# EAGLE schematic Laser_Array (EAGLE 7.7.0)
Laser Array
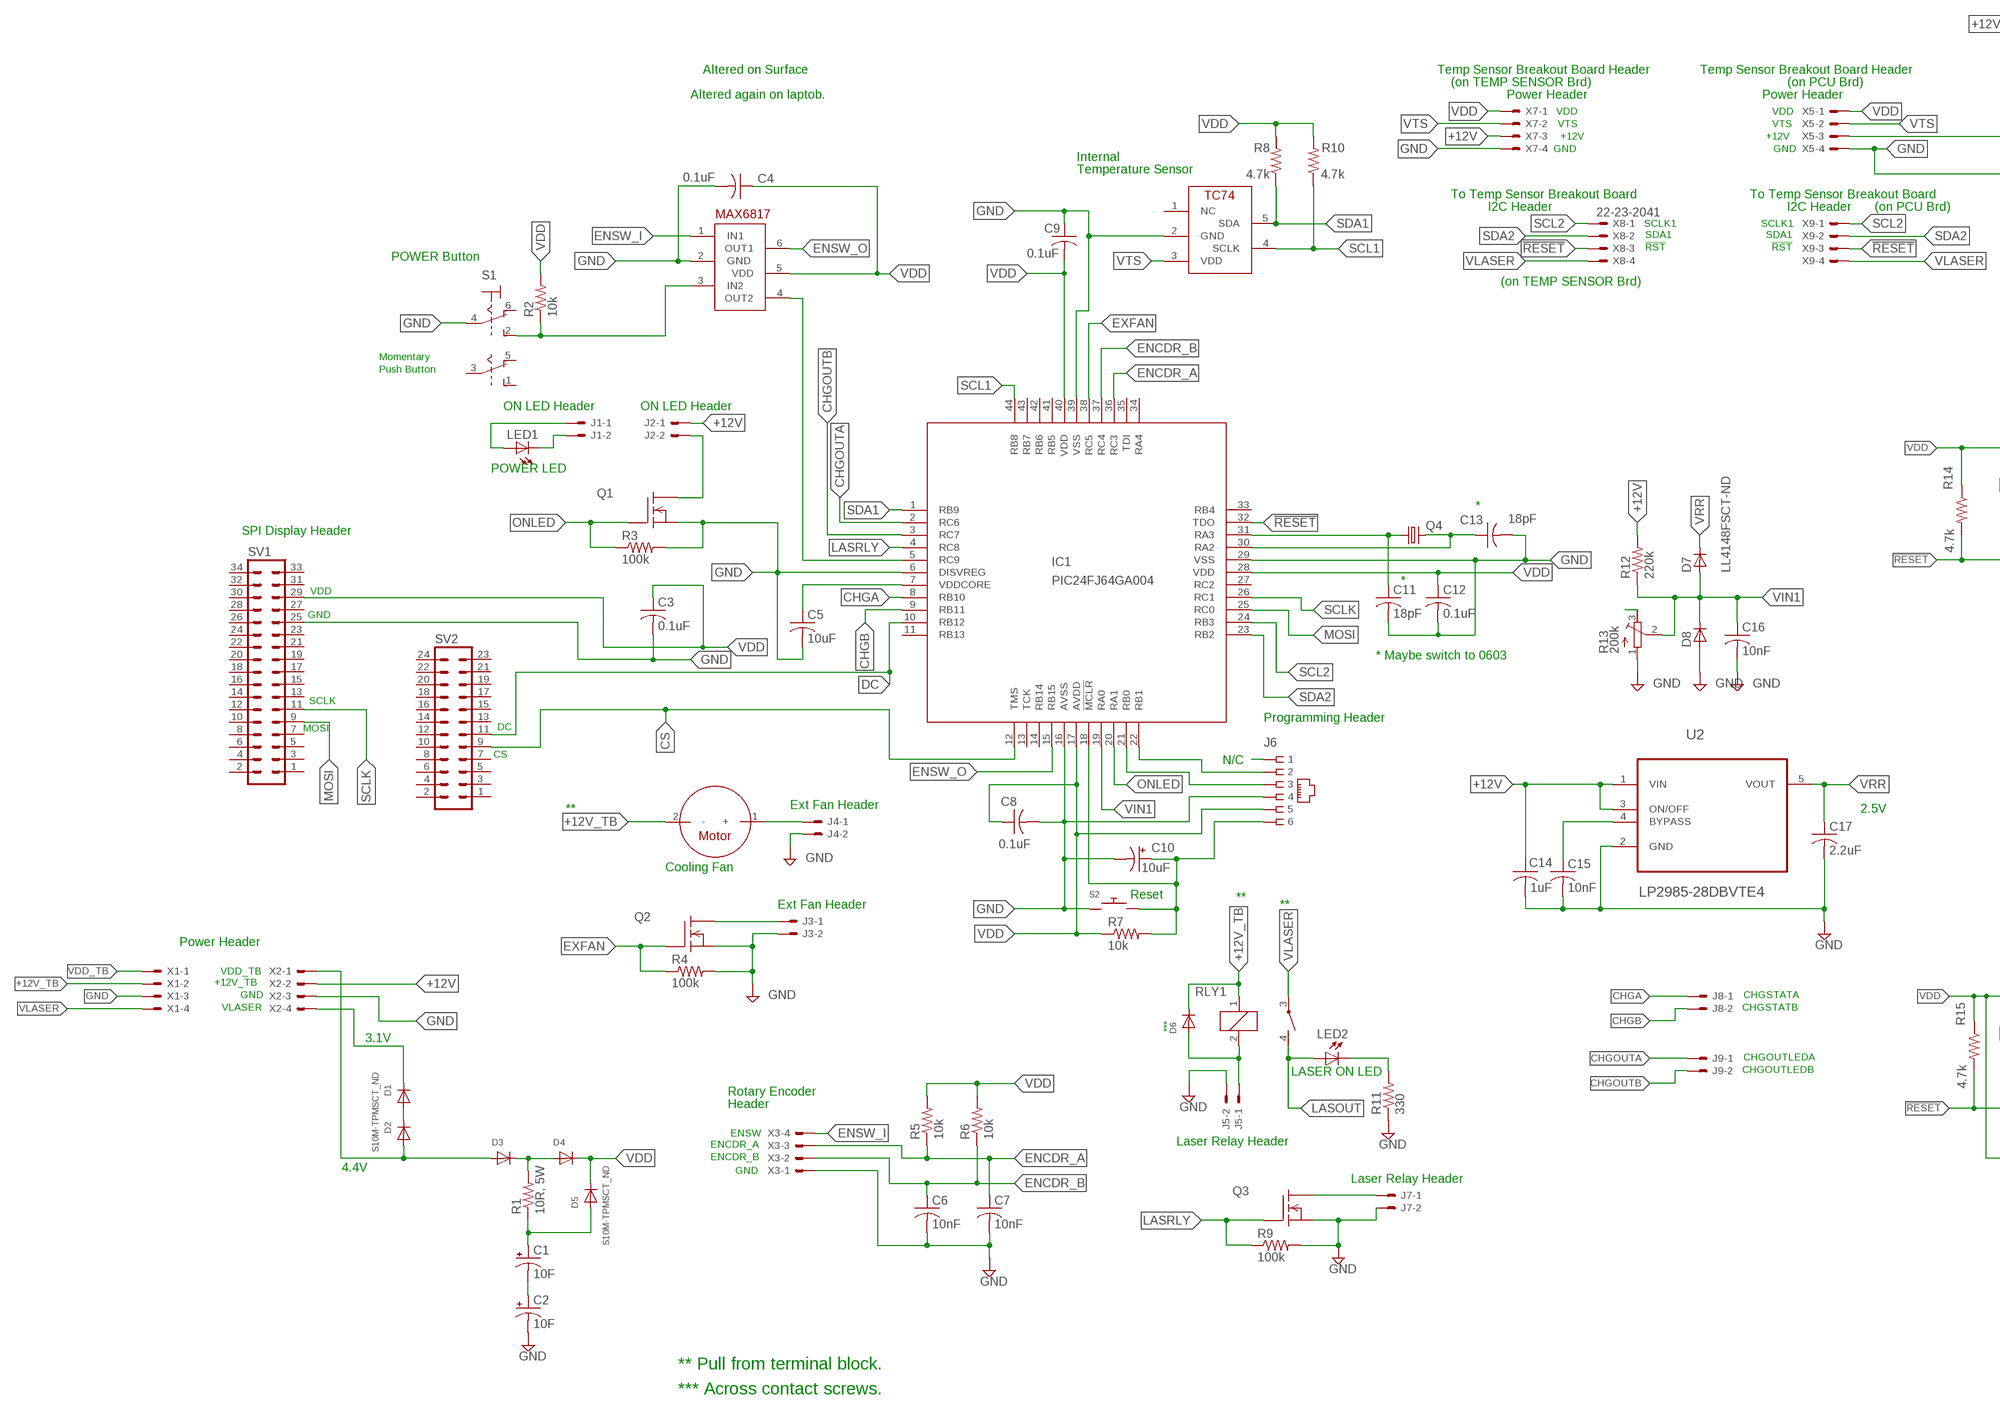
[diagram p0: schematic, sheet 1, part 1 of 2]
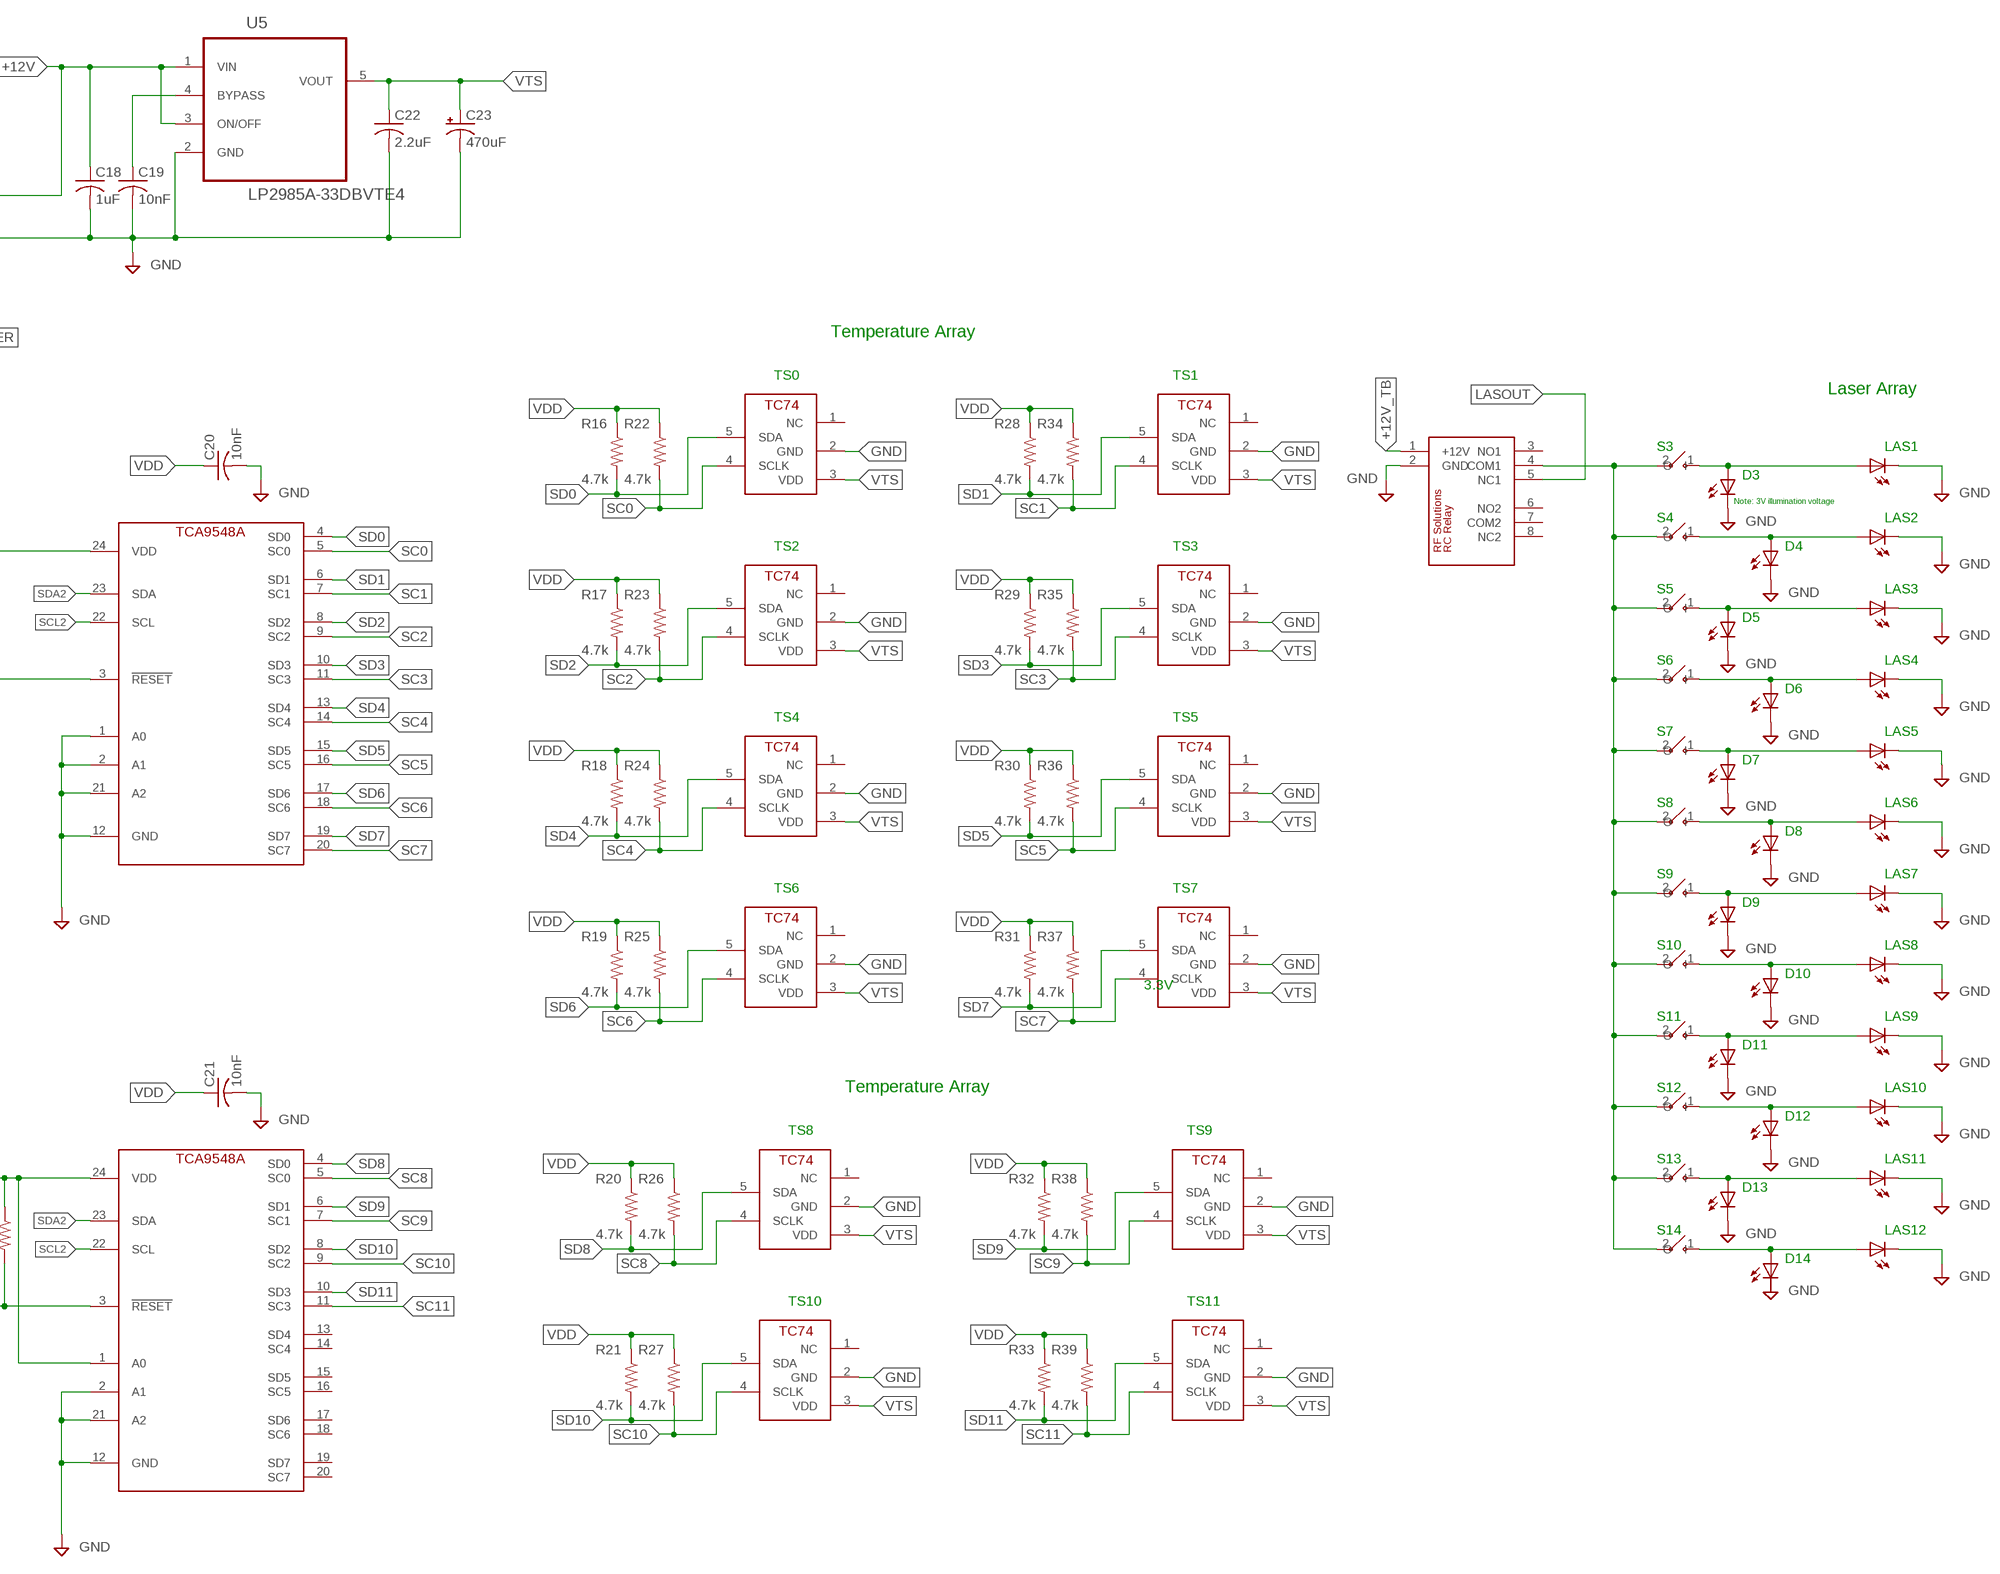
[diagram p1: schematic, sheet 1, part 2 of 2]

## Parts
C1  10F  CPOL-USE5-10.5  [E5-10,5]
C2  10F  CPOL-USE5-10.5  [E5-10,5]
C3  0.1uF  C-USC0805  [C0805]
C4  0.1uF  C-USC0805  [C0805]
C5  10uF  C-USC0805  [C0805]
C6  10nF  C-USC0805  [C0805]
C7  10nF  C-USC0805  [C0805]
C8  0.1uF  C-USC0805  [C0805]
C9  0.1uF  C-USC0805  [C0805]
C10  10uF  CAP3X3  [CAP3X3]
C11  18pF  C-USC0805  [C0805]
C12  0.1uF  C-USC0805  [C0805]
C13  18pF  C-USC0805  [C0805]
C14  1uF  C-USC0805  [C0805]
C15  10nF  C-USC0805  [C0805]
C16  10nF  C-USC0805  [C0805]
C17  2.2uF  C-USC0805  [C0805]
C18  1uF  C-USC0805  [C0805]
C19  10nF  C-USC0805  [C0805]
C20  10nF  C-USC0805  [C0805]
C21  10nF  C-USC0805  [C0805]
C22  2.2uF  C-USC0805  [C0805]
C23  470uF  CPOL-USF  [PANASONIC_F]
D1  S10M-TPMSCT_ND  [S10M-TPMSCT-ND]
D2  641-1014-6-ND  DIODESOD-123  [SOD-123]
D3  641-1014-6-ND  DIODESOD-123  [SOD-123]
D4  641-1014-6-ND  DIODESOD-123  [SOD-123]
D5  S10M-TPMSCT_ND  [S10M-TPMSCT-ND]
D6  641-1014-6-ND  DIODESOD-123  [SOD-123]
D7  LL4148FSCT-ND  D-SOD-80  [SOD80]
D8  LL4148FSCT-ND  D-SOD-80  [SOD80]
IC1  PIC24FJ64GA004  [TQFP44]
J1  22-23-2021  [22-23-2021]
J2  22-23-2021  [22-23-2021]
J3  22-23-2021  [22-23-2021]
J4  22-23-2021  [22-23-2021]
J5  22-23-2021  [22-23-2021]
J6  RJ_25  [RJ11-NO_SHIELD]
J7  22-23-2021  [22-23-2021]
J8  22-23-2021  [22-23-2021]
J9  22-23-2021  [22-23-2021]
LED1  LEDA5MM  [LED5MM]
LED2  LEDA5MM  [LED5MM]
LED3  LED3MM  [LED3MM]
LED4  LED3MM  [LED3MM]
LED5  LED3MM  [LED3MM]
LED6  LED3MM  [LED3MM]
LED7  LED3MM  [LED3MM]
LED8  LED3MM  [LED3MM]
LED9  LED3MM  [LED3MM]
LED10  LED3MM  [LED3MM]
LED11  LED3MM  [LED3MM]
LED12  LED3MM  [LED3MM]
LED13  LED3MM  [LED3MM]
LED14  LED3MM  [LED3MM]
LED15  LED3MM  [LED3MM]
LED16  LED3MM  [LED3MM]
LED17  LED3MM  [LED3MM]
LED18  LED3MM  [LED3MM]
LED19  LED3MM  [LED3MM]
LED20  LED3MM  [LED3MM]
LED21  LED3MM  [LED3MM]
LED22  LED3MM  [LED3MM]
LED23  LED3MM  [LED3MM]
LED24  LED3MM  [LED3MM]
LED25  LED3MM  [LED3MM]
LED26  LED3MM  [LED3MM]
M1  MOTOR  [22-23-2021]
Q1  QS5U34CT-ND_MOSFET_N_CHANNEL  [SOT23-5L]
Q2  QS5U34CT-ND_MOSFET_N_CHANNEL  [SOT23-5L]
Q3  QS5U34CT-ND_MOSFET_N_CHANNEL  [SOT23-5L]
Q4  CRYSTALSM49  [SM49]
R1  10R, 5W  RESISTOR5W  [RESISTOR5W]
R2  10k  R-US_R0805  [R0805]
R3  100k  R-US_R0805  [R0805]
R4  100k  R-US_R0805  [R0805]
R5  10k  R-US_M0805  [M0805]
R6  10k  R-US_M0805  [M0805]
R7  10k  R-US_R0805  [R0805]
R8  4.7k  R-US_M0805  [M0805]
R9  100k  R-US_R0805  [R0805]
R10  4.7k  R-US_M0805  [M0805]
R11  330  R-US_R0805  [R0805]
R12  220k  R-US_M0805  [M0805]
R13  200k  R-TRIMM3224X  [RTRIM3224X]
R14  4.7k  R-US_M0805  [M0805]
R15  4.7k  R-US_M0805  [M0805]
R16  4.7k  R-US_M0805  [M0805]
R17  4.7k  R-US_M0805  [M0805]
R18  4.7k  R-US_M0805  [M0805]
R19  4.7k  R-US_M0805  [M0805]
R20  4.7k  R-US_M0805  [M0805]
R21  4.7k  R-US_M0805  [M0805]
R22  4.7k  R-US_M0805  [M0805]
R23  4.7k  R-US_M0805  [M0805]
R24  4.7k  R-US_M0805  [M0805]
R25  4.7k  R-US_M0805  [M0805]
R26  4.7k  R-US_M0805  [M0805]
R27  4.7k  R-US_M0805  [M0805]
R28  4.7k  R-US_M0805  [M0805]
R29  4.7k  R-US_M0805  [M0805]
R30  4.7k  R-US_M0805  [M0805]
R31  4.7k  R-US_M0805  [M0805]
R32  4.7k  R-US_M0805  [M0805]
R33  4.7k  R-US_M0805  [M0805]
R34  4.7k  R-US_M0805  [M0805]
R35  4.7k  R-US_M0805  [M0805]
R36  4.7k  R-US_M0805  [M0805]
R37  4.7k  R-US_M0805  [M0805]
R38  4.7k  R-US_M0805  [M0805]
R39  4.7k  R-US_M0805  [M0805]
RLY1  RELAY_SPST  [RELAY_SPST]
RLY2  RF_SOLUTIONS_RELAY  [RF_SOLUTIONS_RELAY]
S1  DPDT_TOGGLE  [22-23-2061]
S2  TACT_PB  [PUSHBUTTON_SMD_SJ]
S3  TC74  [SOT23-5L]
S4  TC74  [SOT23-5L]
S5  TC74  [SOT23-5L]
S6  TC74  [SOT23-5L]
S7  TC74  [SOT23-5L]
S8  TC74  [SOT23-5L]
S9  TC74  [SOT23-5L]
S10  TC74  [SOT23-5L]
S11  TC74  [SOT23-5L]
S12  TC74  [SOT23-5L]
S13  TC74  [SOT23-5L]
S14  TC74  [SOT23-5L]
S15  TC74  [SOT23-5L]
S16  TOGGLE_SPST  [22-23-2021]
S17  TOGGLE_SPST  [22-23-2021]
S18  TOGGLE_SPST  [22-23-2021]
S19  TOGGLE_SPST  [22-23-2021]
S20  TOGGLE_SPST  [22-23-2021]
S21  TOGGLE_SPST  [22-23-2021]
S22  TOGGLE_SPST  [22-23-2021]
S23  TOGGLE_SPST  [22-23-2021]
S24  TOGGLE_SPST  [22-23-2021]
S25  TOGGLE_SPST  [22-23-2021]
S26  TOGGLE_SPST  [22-23-2021]
S27  TOGGLE_SPST  [22-23-2021]
SV1  MA17-2W  [MA17-2W]
SV2  MA12-2  [MA12-2]
U1  MAX6817  [SOT23-6]
U2  LP2985-28DBVTE4  [SOT95P280X145-5N]
U3  TCA9548A  [TSSOP24]
U4  TCA9548A  [TSSOP24]
U5  LP2985A-33DBVTE4  [SOT95P280X145-5N]
X1  22-23-2041  [22-23-2041]
X2  22-23-2041  [22-23-2041]
X3  22-23-2041  [22-23-2041]
X5  22-23-2041  [22-23-2041]
X7  22-23-2041  [22-23-2041]
X8  22-23-2041  [22-23-2041]
X9  22-23-2041  [22-23-2041]

## Nets
!RESET: IC1.32(TDO) R14.2 R15.2 U3.3(!RESET) U4.3(!RESET) X8.3 X9.3
+12V: C14.1 C18.1 J2.1 R12.2 U2.1(VIN) U2.3(ON/OFF) U5.1(VIN) U5.3(ON/OFF) X2.2 X5.3 X7.3
+12V_TB: D6.C M1.2(-) RLY1.1 RLY2.1(+12V) X1.2
CHGA: IC1.8(RB10) J8.1
CHGB: IC1.9(RB11) J8.2
CHGOUTA: IC1.2(RC6) J9.1
CHGOUTB: IC1.3(RC7) J9.2
CS: IC1.12(TMS) SV2.9
DC: IC1.10(RB12) SV2.11
ENCDR_A: C7.1 IC1.36(RC3) R5.1 X3.3
ENCDR_B: C6.1 IC1.37(RC4) R6.1 X3.2
ENSW_I: U1.1(IN1) X3.4
ENSW_O: IC1.15(RB15) U1.6(OUT1)
EXFAN: IC1.38(RC5) Q2.1(G) R4.1
GND: C2.- C3.2 C4.2 C5.2 C6.2 C7.2 C8.2 C9.1 C10.- C11.2 C12.2 C13.2 C14.2 C15.2 C16.2 C17.2 C18.2 C19.2 C20.2 C21.2 C22.2 C23.- D8.2(A) IC1.6(DISVREG) IC1.16(AVSS) IC1.29(VSS) IC1.39(VSS) J3.2 J4.2 J5.2 J6.4 J7.2 LED3.K(C) LED4.K(C) LED5.K(C) LED6.K(C) LED7.K(C) LED8.K(C) LED9.K(C) LED10.K(C) LED11.K(C) LED12.K(C) LED13.K(C) LED15.K(C) LED16.K(C) LED17.K(C) LED18.K(C) LED19.K(C) LED20.K(C) LED21.K(C) LED22.K(C) LED23.K(C) LED24.K(C) LED25.K(C) LED26.K(C) Q1.2(S) Q2.2(S) Q3.2(S) R3.2 R4.2 R9.2 R11.1 R13.1(A) RLY2.2(GND) S1.4(P) S2.1 S2.2 S3.2(GND) S4.2(GND) S5.2(GND) S6.2(GND) S7.2(GND) S8.2(GND) S9.2(GND) S10.2(GND) S11.2(GND) S12.2(GND) S13.2(GND) S14.2(GND) S15.2(GND) SV1.25 U1.2(GND) U2.2(GND) U3.1(A0) U3.2(A1) U3.12(GND) U3.21(A2) U4.2(A1) U4.12(GND) U4.21(A2) U5.2(GND) X1.3 X2.3 X3.1 X5.4 X7.4
LASOUT: LED2.A RLY1.4(2:S) RLY2.5(NC1)
LASRLY: IC1.4(RC8) Q3.1(G) R9.1
MOSI: IC1.25(RC0) SV1.9
N$1: C10.+ IC1.18(!MCLR) J6.6 R7.2 S2.3 S2.4
N$2: C5.1 IC1.7(VDDCORE)
N$3: J6.1
N$4: IC1.22(RB1) J6.2
N$5: IC1.21(RB0) J6.3
N$6: C11.1 IC1.31(RA3) Q4.1
N$7: C13.1 IC1.30(RA2) Q4.2
N$8: D1.A D2.C
N$9: R2.1 S1.2(S) U1.3(IN2)
N$10: IC1.5(RC9) U1.4(OUT2)
N$11: J1.2 LED1.K(C)
N$12: J3.1 Q2.5(D)
N$13: R13.3(E)
N$15: D6.A J5.1 RLY1.2
N$16: LED4.A LED17.A S18.1(O)
N$17: RLY2.4(COM1) S16.2(I) S17.2(I) S18.2(I) S19.2(I) S20.2(I) S21.2(I) S22.2(I) S23.2(I) S24.2(I) S25.2(I) S26.2(I) S27.2(I)
N$18: LED3.A LED15.A S16.1(O)
N$19: LED9.A LED16.A S17.1(O)
N$20: LED10.A LED18.A S19.1(O)
N$21: LED5.A LED19.A S20.1(O)
N$22: LED11.A LED20.A S21.1(O)
N$23: LED6.A LED21.A S22.1(O)
N$24: LED12.A LED22.A S23.1(O)
N$25: LED7.A LED23.A S24.1(O)
N$26: LED13.A LED24.A S25.1(O)
N$27: LED8.A LED25.A S26.1(O)
N$28: LED14.A LED26.A S27.1(O)
N$29: LED2.K(C) R11.2
N$30: J1.1 LED1.A
N$31: C19.1 U5.4(BYPASS)
N$32: J2.2 Q1.5(D)
N$33: D3.C D4.A R1.2
N$34: J7.1 Q3.5(D)
N$35: J4.1 M1.1(+)
N$36: C1.- C2.+
N$37: C1.+ D5.A R1.1
N$55: C15.1 U2.4(BYPASS)
ONLED: IC1.20(RA1) Q1.1(G) R3.1
SC0: R22.2 S4.4(SCLK) U3.5(SC0)
SC1: R34.2 S10.4(SCLK) U3.7(SC1)
SC2: R23.2 S5.4(SCLK) U3.9(SC2)
SC3: R35.2 S11.4(SCLK) U3.11(SC3)
SC4: R24.2 S6.4(SCLK) U3.14(SC4)
SC5: R36.2 S12.4(SCLK) U3.16(SC5)
SC6: R25.2 S7.4(SCLK) U3.18(SC6)
SC7: R37.2 S13.4(SCLK) U3.20(SC7)
SC8: R26.2 S8.4(SCLK) U4.5(SC0)
SC9: R38.2 S14.4(SCLK) U4.7(SC1)
SC10: R27.2 S9.4(SCLK) U4.9(SC2)
SC11: R39.2 S15.4(SCLK) U4.11(SC3)
SCL1: IC1.44(RB8) R10.1 S3.4(SCLK)
SCL2: IC1.24(RB3) U3.22(SCL) U4.22(SCL) X8.1 X9.1
SCLK: IC1.26(RC1) SV1.11
SD0: R16.2 S4.5(SDA) U3.4(SD0)
SD1: R28.2 S10.5(SDA) U3.6(SD1)
SD2: R17.2 S5.5(SDA) U3.8(SD2)
SD3: R29.2 S11.5(SDA) U3.10(SD3)
SD4: R18.2 S6.5(SDA) U3.13(SD4)
SD5: R30.2 S12.5(SDA) U3.15(SD5)
SD6: R19.2 S7.5(SDA) U3.17(SD6)
SD7: R31.2 S13.5(SDA) U3.19(SD7)
SD8: R20.2 S8.5(SDA) U4.4(SD0)
SD9: R32.2 S14.5(SDA) U4.6(SD1)
SD10: R21.2 S9.5(SDA) U4.8(SD2)
SD11: R33.2 S15.5(SDA) U4.10(SD3)
SDA1: IC1.1(RB9) R8.1 S3.5(SDA)
SDA2: IC1.23(RB2) U3.23(SDA) U4.23(SDA) X8.2 X9.2
VDD: C3.1 C4.1 C8.1 C9.2 C12.1 C20.1 C21.1 D4.C D5.C IC1.17(AVDD) IC1.28(VDD) IC1.40(VDD) J6.5 R2.2 R5.2 R6.2 R7.1 R8.2 R10.2 R14.1 R15.1 R16.1 R17.1 R18.1 R19.1 R20.1 R21.1 R22.1 R23.1 R24.1 R25.1 R26.1 R27.1 R28.1 R29.1 R30.1 R31.1 R32.1 R33.1 R34.1 R35.1 R36.1 R37.1 R38.1 R39.1 SV1.29 U1.5(VDD) U3.24(VDD) U4.1(A0) U4.24(VDD) X5.1 X7.1
VDD_TB: D2.A D3.A X1.1 X2.1
VIN1: C16.1 D7.2(A) D8.1(C) IC1.19(RA0) R12.1 R13.2(S)
VLASER: D1.C RLY1.3(2:P) X1.4 X2.4 X8.4 X9.4
VRR: C17.1 D7.1(C) U2.5(VOUT)
VTS: C22.1 C23.+ S3.3(VDD) S4.3(VDD) S5.3(VDD) S6.3(VDD) S7.3(VDD) S8.3(VDD) S9.3(VDD) S10.3(VDD) S11.3(VDD) S12.3(VDD) S13.3(VDD) S14.3(VDD) S15.3(VDD) U5.5(VOUT) X5.2 X7.2
Unconnected: IC1.11(RB13) IC1.13(TCK) IC1.14(RB14) IC1.27(RC2) IC1.33(RB4) IC1.34(RA4) IC1.35(TDI) IC1.41(RB5) IC1.42(RB6) IC1.43(RB7) LED14.K(C) RLY2.3(NO1) RLY2.6(NO2) RLY2.7(COM2) RLY2.8(NC2) S1.1(S1) S1.3(P1) S1.5(O1) S1.6(O) S3.1(NC) S4.1(NC) S5.1(NC) S6.1(NC) S7.1(NC) S8.1(NC) S9.1(NC) S10.1(NC) S11.1(NC) S12.1(NC) S13.1(NC) S14.1(NC) S15.1(NC) SV1.1 SV1.2 SV1.3 SV1.4 SV1.5 SV1.6 SV1.7 SV1.8 SV1.10 SV1.12 SV1.13 SV1.14 SV1.15 SV1.16 SV1.17 SV1.18 SV1.19 SV1.20 SV1.21 SV1.22 SV1.23 SV1.24 SV1.26 SV1.27 SV1.28 SV1.30 SV1.31 SV1.32 SV1.33 SV1.34 SV2.1 SV2.2 SV2.3 SV2.4 SV2.5 SV2.6 SV2.7 SV2.8 SV2.10 SV2.12 SV2.13 SV2.14 SV2.15 SV2.16 SV2.17 SV2.18 SV2.19 SV2.20 SV2.21 SV2.22 SV2.23 SV2.24 U4.13(SD4) U4.14(SC4) U4.15(SD5) U4.16(SC5) U4.17(SD6) U4.18(SC6) U4.19(SD7) U4.20(SC7)

## Notes on the sheet
- Altered on Surface | Temp Sensor Breakout Board Header | Temp Sensor Breakout Board Header
- (on TEMP SENSOR Brd) | (on PCU Brd)
- Altered again on laptob. | Power Header | Power Header
- VDD | VDD
- VTS | VTS
- +12V | +12V
- GND | GND
- Internal
- Temperature Sensor
- To Temp Sensor Breakout Board | To Temp Sensor Breakout Board
- I2C Header | I2C Header | (on PCU Brd)
- SCLK1 | SCLK1
- SDA1 | SDA1
- !RST | !RST
- POWER Button | Temperature Array
- (on TEMP SENSOR Brd)
- TS0 | TS1
- Laser Array
- Momentary | S3 | LAS1
- Push Button
- D3
- Note: 3V illumination voltage
- ON LED Header | ON LED Header
- S4 | LAS2
- TS2 | TS3 | D4
- POWER LED
- S5 | LAS3
- * | D5
- SPI Display Header
- S6 | LAS4
- D6
- *
- VDD | TS4 | TS5
- S7 | LAS5
- GND
- D7
- * Maybe switch to 0603
- S8 | LAS6
- D8
- SCLK
- Programming Header
- MOSI | DC
- S9 | LAS7
- TS6 | TS7
- CS | D9
- N/C
- S10 | LAS8
- Ext Fan Header
- ** | 2.5V
- D10
- 3.3V
- S11 | LAS9
- Cooling Fan
- D11
- **
- Reset
- Ext Fan Header | **
- Temperature Array | S12 | LAS10
- Power Header | D12
- TS8 | TS9
- VDD_TB
- +12V_TB | S13 | LAS11
- GND | CHGSTATA
- VLASER | CHGSTATB | D13
- ***
- 3.1V
- S14 | LAS12
- CHGOUTLEDA
- CHGOUTLEDB | D14
- LASER ON LED
- Rotary Encoder
- Header | TS10 | TS11
- ENSW
- ENCDR_A | Laser Relay Header
- ENCDR_B
- 4.4V | GND
- Laser Relay Header
- ** Pull from terminal block.
- *** Across contact screws.

## Library data of the parts
C1 C2 C23 = rcl:CPOL-US: POLARIZED CAPACITOR, American symbol
C3-C9 C11-C22 = rcl:C-US: CAPACITOR, American symbol
C10 = Mine:CAP3X3: capacitor - electrolytic This is from the Nichicon 3mm series
D1 D5 = Mine:S10M-TPMSCT_ND
D2-D4 D6 = adafruit:DIODE: Diode SMADIODE - SMA Surface Mount Package 20V 1A Schottky Diode Digikey: 641-1014-6-ND DO-1N4148 - Through Hole Small Current Diode SOD-123 20V 1 A (.5mV Vf) Schottky Diode - Digikey: MBRX120TPMSCT-ND SOD-323 10V 570mA (.38mV Vf, 3ns) Schottky Diode - Digikey: ZLLS410CT-ND SOD-523 30V 30mA Schottky Diode (RB751S-40TE61) - Digikey: RB751S-40TE61CT-ND SOT23-R/W - SOT23 Package (R = Solder Paste/Reflow Ovens, W = Hand-Soldering) BAT54Film 40V 300mA - Digikey: 497-7162-1-ND
D7 D8 = semicon-smd-ipc:D-: DIODE unfilled
IC1 = microchip:PIC24FJ64GA004: PIC24FJ64GA004 edit this description Auto generated by make-symbol-device-package-bsdl.ulp Rev. 25 Source: PIC24FJ64GA004.bsd; MPN: PIC24FJ64GA004-E/PT; OC_FARNELL: 1332299; OC_NEWARK: 98M1927
J1-J5 J7-J9 = Mine:22-23-2021: .100" (2.54mm) Center Header - 2 Pin; MF: MOLEX; MPN: 22-23-2021; OC_FARNELL: 1462926; OC_NEWARK: 25C3832
J6 = Mine:RJ_25: RJ_25 Package: RJ_25 through hole Digikey Part # A311422-ND
LED1 LED2 = Mine:LEDA: LED OSRAM: - CHIPLED LG R971, LG N971, LY N971, LG Q971, LY Q971, LO R971, LY R971 LH N974, LH R974 LS Q976, LO Q976, LY Q976 LO Q996 - Hyper CHIPLED LW Q18S LB Q993, LB Q99A, LB R99A - SideLED LS A670, LO A670, LY A670, LG A670, LP A670 LB A673, LV A673, LT A673, LW A673 LH A674 LY A675 LS A676, LA A676, LO A676, LY A676, LW A676 LS A679, LY A679, LG A679 - Hyper Micro SIDELED® LS Y876, LA Y876, LO Y876, LY Y876 LT Y87S - SmartLED LW L88C, LW L88S LB L89C, LB L89S, LG L890 LS L89K, LO L89K, LY L89K LS L896, LA L896, LO L896, LY L896 - TOPLED LS T670, LO T670, LY T670, LG T670, LP T670 LSG T670, LSP T670, LSY T670, LOP T670, LYG T670 LG T671, LOG T671, LSG T671 LB T673, LV T673, LT T673, LW T673 LH T674 LS T676, LA T676, LO T676, LY T676, LB T676, LH T676, LSB T676, LW T676 LB T67C, LV T67C, LT T67C, LS T67K, LO T67K, LY T67K, LW E67C LS E67B, LA E67B, LO E67B, LY E67B, LB E67C, LV E67C, LT E67C LW T67C LS T679, LY T679, LG T679 LS T770, LO T770, LY T770, LG T770, LP T770 LB T773, LV T773, LT T773, LW T773 LH T774 LS E675, LA E675, LY E675, LS T675 LS T776, LA T776, LO T776, LY T776, LB T776 LHGB T686 LT T68C, LB T68C - Hyper Mini TOPLED® LB M676 - Mini TOPLED Santana® LG M470 LS M47K, LO M47K, LY M47K Source: http://www.osram.convergy.de/
LED3-LED26 = Mine:LED: LED OSRAM: - CHIPLED LG R971, LG N971, LY N971, LG Q971, LY Q971, LO R971, LY R971 LH N974, LH R974 LS Q976, LO Q976, LY Q976 LO Q996 - Hyper CHIPLED LW Q18S LB Q993, LB Q99A, LB R99A - SideLED LS A670, LO A670, LY A670, LG A670, LP A670 LB A673, LV A673, LT A673, LW A673 LH A674 LY A675 LS A676, LA A676, LO A676, LY A676, LW A676 LS A679, LY A679, LG A679 - Hyper Micro SIDELED® LS Y876, LA Y876, LO Y876, LY Y876 LT Y87S - SmartLED LW L88C, LW L88S LB L89C, LB L89S, LG L890 LS L89K, LO L89K, LY L89K LS L896, LA L896, LO L896, LY L896 - TOPLED LS T670, LO T670, LY T670, LG T670, LP T670 LSG T670, LSP T670, LSY T670, LOP T670, LYG T670 LG T671, LOG T671, LSG T671 LB T673, LV T673, LT T673, LW T673 LH T674 LS T676, LA T676, LO T676, LY T676, LB T676, LH T676, LSB T676, LW T676 LB T67C, LV T67C, LT T67C, LS T67K, LO T67K, LY T67K, LW E67C LS E67B, LA E67B, LO E67B, LY E67B, LB E67C, LV E67C, LT E67C LW T67C LS T679, LY T679, LG T679 LS T770, LO T770, LY T770, LG T770, LP T770 LB T773, LV T773, LT T773, LW T773 LH T774 LS E675, LA E675, LY E675, LS T675 LS T776, LA T776, LO T776, LY T776, LB T776 LHGB T686 LT T68C, LB T68C - Hyper Mini TOPLED® LB M676 - Mini TOPLED Santana® LG M470 LS M47K, LO M47K, LY M47K Source: http://www.osram.convergy.de/
M1 = Mine:MOTOR
Q1-Q3 = Mine:QS5U34CT-ND_MOSFET_N_CHANNEL: QS5U34CT-ND Enhancement mode, N-channel MOSFET Package: SOT 23-5
Q4 = adafruit:CRYSTAL: CRYSTAL; OC_FARNELL: unknown; OC_NEWARK: unknown
R1 = Mine:RESISTOR5W: 5W SMD resistor, uses standard 5W through hole resistor.
R2-R12 R14-R39 = rcl:R-US_: RESISTOR, American symbol
R13 = rcl:R-TRIMM: Trimm resistor
RLY1 = Mine:RELAY_SPST: Miniature PCB Relay 1 pole 6 A SCHRACK Source: http://www.schrack.com/.. 5812.pdf
RLY2 = Mine:RF_SOLUTIONS_RELAY
S1 = Mine:DPDT_TOGGLE
S2 = Mine:TACT_PB: Surfacemount tactile push button 6mm body Digikeyn part£:n CKN9085ct-nd
S3-S15 = Mine:TC74
S16-S27 = Mine:TOGGLE_SPST: SPST Toggle SPST toggle switch with no package
SV1 = con-lstb:MA17-2W: PIN HEADER; OC_FARNELL: unknown; OC_NEWARK: unknown
SV2 = con-lstb:MA12-2: PIN HEADER; OC_FARNELL: unknown; OC_NEWARK: unknown
U1 = Mine:MAX6817: MAX6817 2 channel CMOS switch debouncer Package SOT 23-6
U2 = Texas Instruments_By_element14_Batch_1:LP2985-28DBVTE4: LOW-NOISE LOW-DROPOUT REGULATOR WITH SHUTDOWN; MPN: LP2985-28DBVTE4; OC_FARNELL: 1053676; OC_NEWARK: 97K3681; PACKAGE: SOT-23-5; SUPPLIER: Texas Instruments
U3 U4 = Mine:TCA9548A
U5 = Texas Instruments_By_element14_Batch_1:LP2985A-33DBVTE4: 150-mA LOW-NOISE LOW-DROPOUT REGULATOR WITH SHUTDOWN; MPN: LP2985A-33DBVTE4; OC_FARNELL: 1053660; OC_NEWARK: 79K3928; PACKAGE: SOT-23-5; SUPPLIER: Texas Instruments
X1-X3 X5 X7-X9 = Mine:22-23-2041: .100" (2.54mm) Center Header - 4 Pin; MF: MOLEX; MPN: 22-23-2041; OC_FARNELL: 1462920; OC_NEWARK: 38C0355

## Net classes
0 default: width 0.254 mm, drill 0.508 mm, clearance 0.203 mm